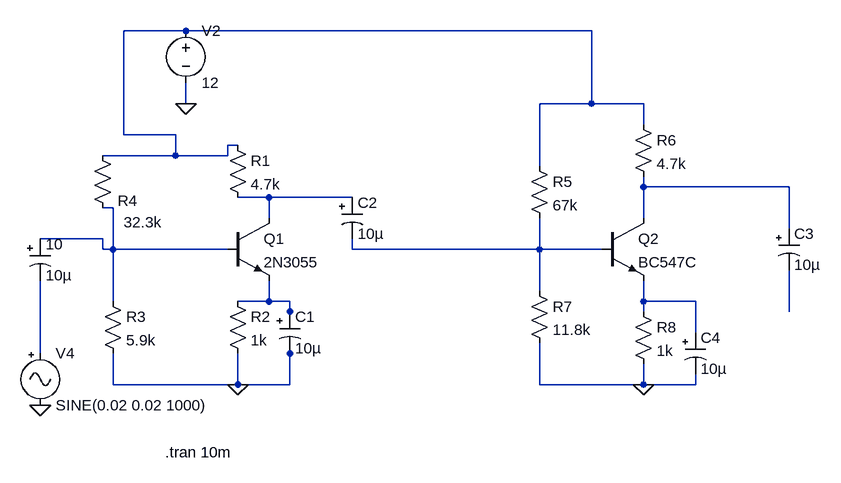
[diagram p0: schematic exp4(two stage amplifier).asc]
exp4(two stage amplifier).asc, the LTspice schematic file:
Version 4
SHEET 1 1288 680
WIRE 304 -128 208 -128
WIRE 928 -128 304 -128
WIRE 304 -16 304 -48
WIRE 928 -16 928 -128
WIRE 928 -16 848 -16
WIRE 1008 -16 928 -16
WIRE 1008 16 1008 -16
WIRE 208 32 208 -128
WIRE 288 32 208 32
WIRE 384 48 368 48
WIRE 288 64 288 32
WIRE 288 64 176 64
WIRE 368 64 368 48
WIRE 368 64 288 64
WIRE 848 80 848 -16
WIRE 1008 112 1008 96
WIRE 1232 112 1008 112
WIRE 432 128 384 128
WIRE 560 128 432 128
WIRE 192 144 176 144
WIRE 432 160 432 128
WIRE 1008 160 1008 112
WIRE 1232 176 1232 112
WIRE 176 192 80 192
WIRE 176 208 176 192
WIRE 192 208 192 144
WIRE 192 208 176 208
WIRE 368 208 192 208
WIRE 560 208 560 192
WIRE 848 208 848 160
WIRE 848 208 560 208
WIRE 944 208 848 208
WIRE 848 272 848 208
WIRE 192 288 192 208
WIRE 432 288 432 256
WIRE 432 288 384 288
WIRE 464 288 432 288
WIRE 1008 288 1008 256
WIRE 1088 288 1008 288
WIRE 464 304 464 288
WIRE 1008 304 1008 288
WIRE 1232 304 1232 240
WIRE 464 320 464 304
WIRE 1088 336 1088 288
WIRE 80 368 80 256
WIRE 464 368 464 352
WIRE 192 416 192 368
WIRE 384 416 384 368
WIRE 384 416 192 416
WIRE 464 416 464 368
WIRE 464 416 384 416
WIRE 848 416 848 352
WIRE 1008 416 1008 384
WIRE 1008 416 848 416
WIRE 1088 416 1088 400
WIRE 1088 416 1008 416
FLAG 384 416 0
FLAG 304 -16 0
FLAG 80 448 0
FLAG 1008 416 0
SYMBOL npn 368 160 R0
SYMATTR InstName Q1
SYMATTR Value 2N3055
SYMBOL res 368 32 R0
SYMATTR InstName R1
SYMATTR Value 4.7k
SYMBOL res 368 272 R0
SYMATTR InstName R2
SYMATTR Value 1k
SYMBOL res 176 272 R0
SYMATTR InstName R3
SYMATTR Value 5.9k
SYMBOL res 160 48 R0
WINDOW 0 39 85 Left 2
WINDOW 3 48 118 Left 2
SYMATTR InstName R4
SYMATTR Value 32.3k
SYMBOL polcap 448 304 R0
WINDOW 3 24 56 Left 2
SYMATTR InstName C1
SYMATTR Value 10µ
SYMATTR SpiceLine Rser=4 Lser=0 mfg="AVX" pn="TAJA106M006" type="Tantalum"
SYMATTR Description Capacitor
SYMATTR Type cap
SYMBOL polcap 64 192 R0
WINDOW 3 24 56 Left 2
SYMATTR Value 10µ
SYMATTR InstName 10
SYMATTR Description Capacitor
SYMATTR Type cap
SYMATTR SpiceLine Rser=4 Lser=0 mfg="AVX" pn="TAJA106M006" type="Tantalum"
SYMBOL voltage 304 -144 R0
SYMATTR InstName V2
SYMATTR Value 12
SYMBOL Misc/signal 80 352 R0
SYMATTR InstName V4
SYMATTR Value SINE(0.02 0.02 1000)
SYMATTR Value2 AC 0.02
SYMBOL polcap 544 128 R0
WINDOW 3 24 56 Left 2
SYMATTR Value 10µ
SYMATTR InstName C2
SYMATTR Description Capacitor
SYMATTR Type cap
SYMATTR SpiceLine Rser=4 Lser=0 mfg="AVX" pn="TAJA106M006" type="Tantalum"
SYMBOL npn 944 160 R0
SYMATTR InstName Q2
SYMATTR Value BC547C
SYMBOL res 832 64 R0
SYMATTR InstName R5
SYMATTR Value 67k
SYMBOL res 992 0 R0
SYMATTR InstName R6
SYMATTR Value 4.7k
SYMBOL res 832 256 R0
SYMATTR InstName R7
SYMATTR Value 11.8k
SYMBOL res 992 288 R0
SYMATTR InstName R8
SYMATTR Value 1k
SYMBOL polcap 1216 176 R0
WINDOW 3 24 56 Left 2
SYMATTR InstName C3
SYMATTR Value 10µ
SYMATTR Description Capacitor
SYMATTR Type cap
SYMATTR SpiceLine Rser=4 Lser=0 mfg="AVX" pn="TAJA106M006" type="Tantalum"
SYMBOL polcap 1072 336 R0
WINDOW 3 24 56 Left 2
SYMATTR InstName C4
SYMATTR Value 10µ
SYMATTR Description Capacitor
SYMATTR Type cap
SYMATTR SpiceLine Rser=4 Lser=0 mfg="AVX" pn="TAJA106M006" type="Tantalum"
TEXT 272 520 Left 2 !.tran 10m

The netlist it stands for:
* exp4(two stage amplifier).asc
Q1 N003 N004 N006 0 2N3055
R1 N001 N003 4.7k
R2 N006 0 1k
R3 N004 0 5.9k
R4 N001 N004 32.3k
C1 N006 0 10µ Rser=4 Lser=0 mfg="AVX" pn="TAJA106M006" type="Tantalum"
C§10 N004 N009 10µ Rser=4 Lser=0 mfg="AVX" pn="TAJA106M006" type="Tantalum"
V2 N001 0 12
V4 N009 0 SINE(0.02 0.02 1000) AC 0.02
C2 N003 N005 10µ Rser=4 Lser=0 mfg="AVX" pn="TAJA106M006" type="Tantalum"
Q2 N002 N005 N007 0 BC547C
R5 N001 N005 67k
R6 N001 N002 4.7k
R7 N005 0 11.8k
R8 N007 0 1k
C3 N002 N008 10µ Rser=4 Lser=0 mfg="AVX" pn="TAJA106M006" type="Tantalum"
C4 N007 0 10µ Rser=4 Lser=0 mfg="AVX" pn="TAJA106M006" type="Tantalum"
.model NPN NPN
.model PNP PNP
.lib standard.bjt
.tran 10m
.backanno
.end